# EAGLE design usb2ttlrs (EAGLE 5.10)
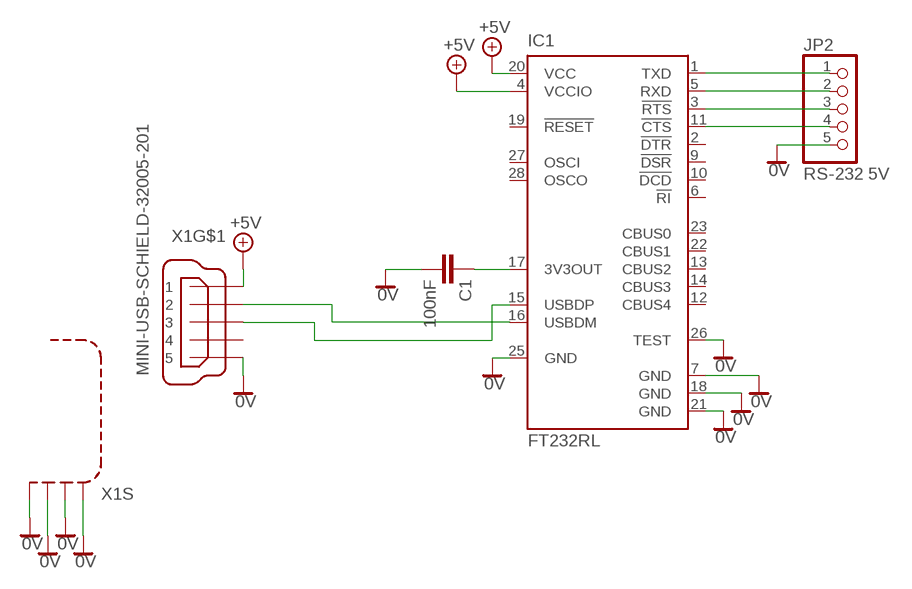
[diagram p0: schematic, sheet 1]

## Parts
C1  100nF  C-EUC0603K  [C0603K]
IC1  FT232RL  [SSOP28]
JP2  RS-232 5V  PINHD-1X5  [1X05]
X1  MINI-USB-SCHIELD-32005-201  [32005-201]

## Nets
0V: C1.2 IC1.7(GND) IC1.18(GND) IC1.21(GND) IC1.25(GND) IC1.26(TEST) JP2.5 X1.5 X1.M1(S:S1) X1.M2(S:S2) X1.M3(S:S3) X1.M4(S:S4)
+5V: IC1.4(VCCIO) IC1.20(VCC) X1.1
N$1: C1.1 IC1.17(3V3OUT)
N$2: IC1.16(USBDM) X1.2
N$3: IC1.15(USBDP) X1.3
N$4: IC1.1(TXD) JP2.1
N$5: IC1.5(RXD) JP2.2
N$6: IC1.3(!RTS) JP2.3
N$7: IC1.11(!CTS) JP2.4
Unconnected: IC1.2(!DTR) IC1.6(!RI) IC1.9(!DSR) IC1.10(!DCD) IC1.12(CBUS4) IC1.13(CBUS2) IC1.14(CBUS3) IC1.19(!RESET) IC1.22(CBUS1) IC1.23(CBUS0) IC1.27(OSCI) IC1.28(OSCO) X1.4

## Library data of the parts
C1 = rcl:C-EU: CAPACITOR, European symbol
IC1 = ftdichip:FT232R: Source: http://www.ftdichip.com/Documents/DataSheets/DS_FT232R_v104.pdf
JP2 = pinhead:PINHD-1X5: PIN HEADER
X1 = con-cypressindustries:MINI-USB-SCHIELD-: MINI USB-B Conector Source: www.cypressindustries.com

## Board
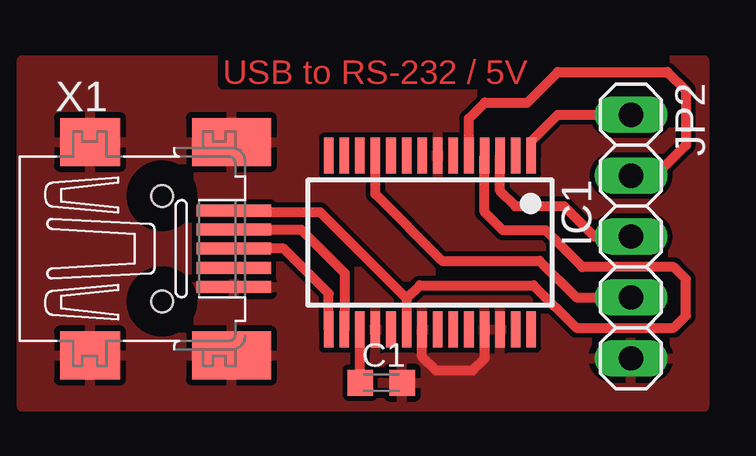
[diagram p1: board, top side]

No outline drawn. Coordinates in mm, seen from the top.
Copper layers (1*16): Top 0.035mm / dielectric 1.5mm / Bottom 0.035mm
Design rules "default": minimum track width 10mil, minimum drill 24mil, track to track 8mil, track to pad 8mil, pad to pad 8mil, via to via 8mil, smd to smd 8mil, copper to edge 40mil, drill to drill 8mil, minimum pad ring 10mil, minimum via ring 8mil, stop-mask expansion 4mil, vias tented up to drill 0mil, thermal gap 10mil

### Footprints (pad centres in the part's own frame; a part is rotated, then mirrored left to right if it is on the bottom)
C0603K = smd 1.05 x 1.08: 1 -0.875,0; 2 0.875,0
SSOP28 = smd 0.4 x 1.5: 1 -4.225,-3.625; 2 -3.575,-3.625; 3 -2.925,-3.625; 4 -2.275,-3.625; 5 -1.625,-3.625; 6 -0.975,-3.625; 7 -0.325,-3.625; 8 0.325,-3.625; 9 0.975,-3.625; 10 1.625,-3.625; 11 2.275,-3.625; 12 2.925,-3.625; 13 3.575,-3.625; 14 4.225,-3.625; 15 4.225,3.625; 16 3.575,3.625; 17 2.925,3.625; 18 2.275,3.625; 19 1.625,3.625; 20 0.975,3.625; 21 0.325,3.625; 22 -0.325,3.625; 23 -0.975,3.625; 24 -1.625,3.625; 25 -2.275,3.625; 26 -2.925,3.625; 27 -3.575,3.625; 28 -4.225,3.625
1X05 = drill 1.016 long: 1 -5.08,0; 2 -2.54,0; 3 0,0; 4 2.54,0; 5 5.08,0
32005-201 = smd 3.1 x 0.5: 1 3,1.6; 2 3,0.8; 3 3,0; 4 3,-0.8; 5 3,-1.6 | smd 2.5 x 2: M1 -3,-4.45; M2 -3,4.45 | smd 3.3 x 2: M3 2.9,4.45; M4 2.9,-4.45 | hole 0.9: 0,2.2; 0,-2.2

### Placement (x,y rotation side)
C1  14.22,3.3 0 top
IC1  16.26,9.14 180 top
JP2  24.64,9.4 270 top
X1  5.08,8.89 0 top

### Tracks (layer width: path | path; a pad name or v marks a point on that pad's centre or on a via)
0V
  Top 0.406: IC1.21 15.93,4.39 16.51,3.81 18.03,3.81 18.54,4.32 18.54,5.51 IC1.25
  pour Top: 27.69,16.76 27.69,2.29 -0.76,2.29 -0.76,16.76
+5V
  Top 0.406: 15.28,6.82 IC1.20 | 15.28,6.82 11.68,10.41 8.16,10.41 X1.1 | IC1.4 18.53,10.43 19.3,9.65 21.08,9.65 22.61,8.13 26.42,8.13 26.92,7.62 26.92,6.1 26.42,5.59 22.35,5.59 20.57,7.37 15.83,7.37 15.28,6.82
N$1
  Top 0.406: IC1.17 13.33,3.32 C1.1
N$2
  Top 0.406: X1.2 10.88,9.69 12.7,7.87 12.7,5.54 IC1.16
N$3
  Top 0.406: IC1.15 12.03,7.02 10.16,8.89 X1.3
N$4
  Top 0.406: IC1.1 20.48,13.37 21.59,14.48 JP2.1
N$5
  Top 0.406: JP2.2 25.65,11.94 26.92,13.21 26.92,15.49 26.16,16.26 21.59,16.26 20.32,14.99 18.54,14.99 17.88,14.32 IC1.5
N$6
  Top 0.406: JP2.3 23.11,9.4 21.84,10.67 19.81,10.67 19.18,11.3 IC1.3
N$7
  Top 0.406: JP2.4 22.35,6.86 20.83,8.38 16.76,8.38 13.98,11.16 IC1.11

### Text on the board
Top: USB to RS-232 / 5V